# EAGLE design PCB111000_1_V2_CC (EAGLE 9.5.2)
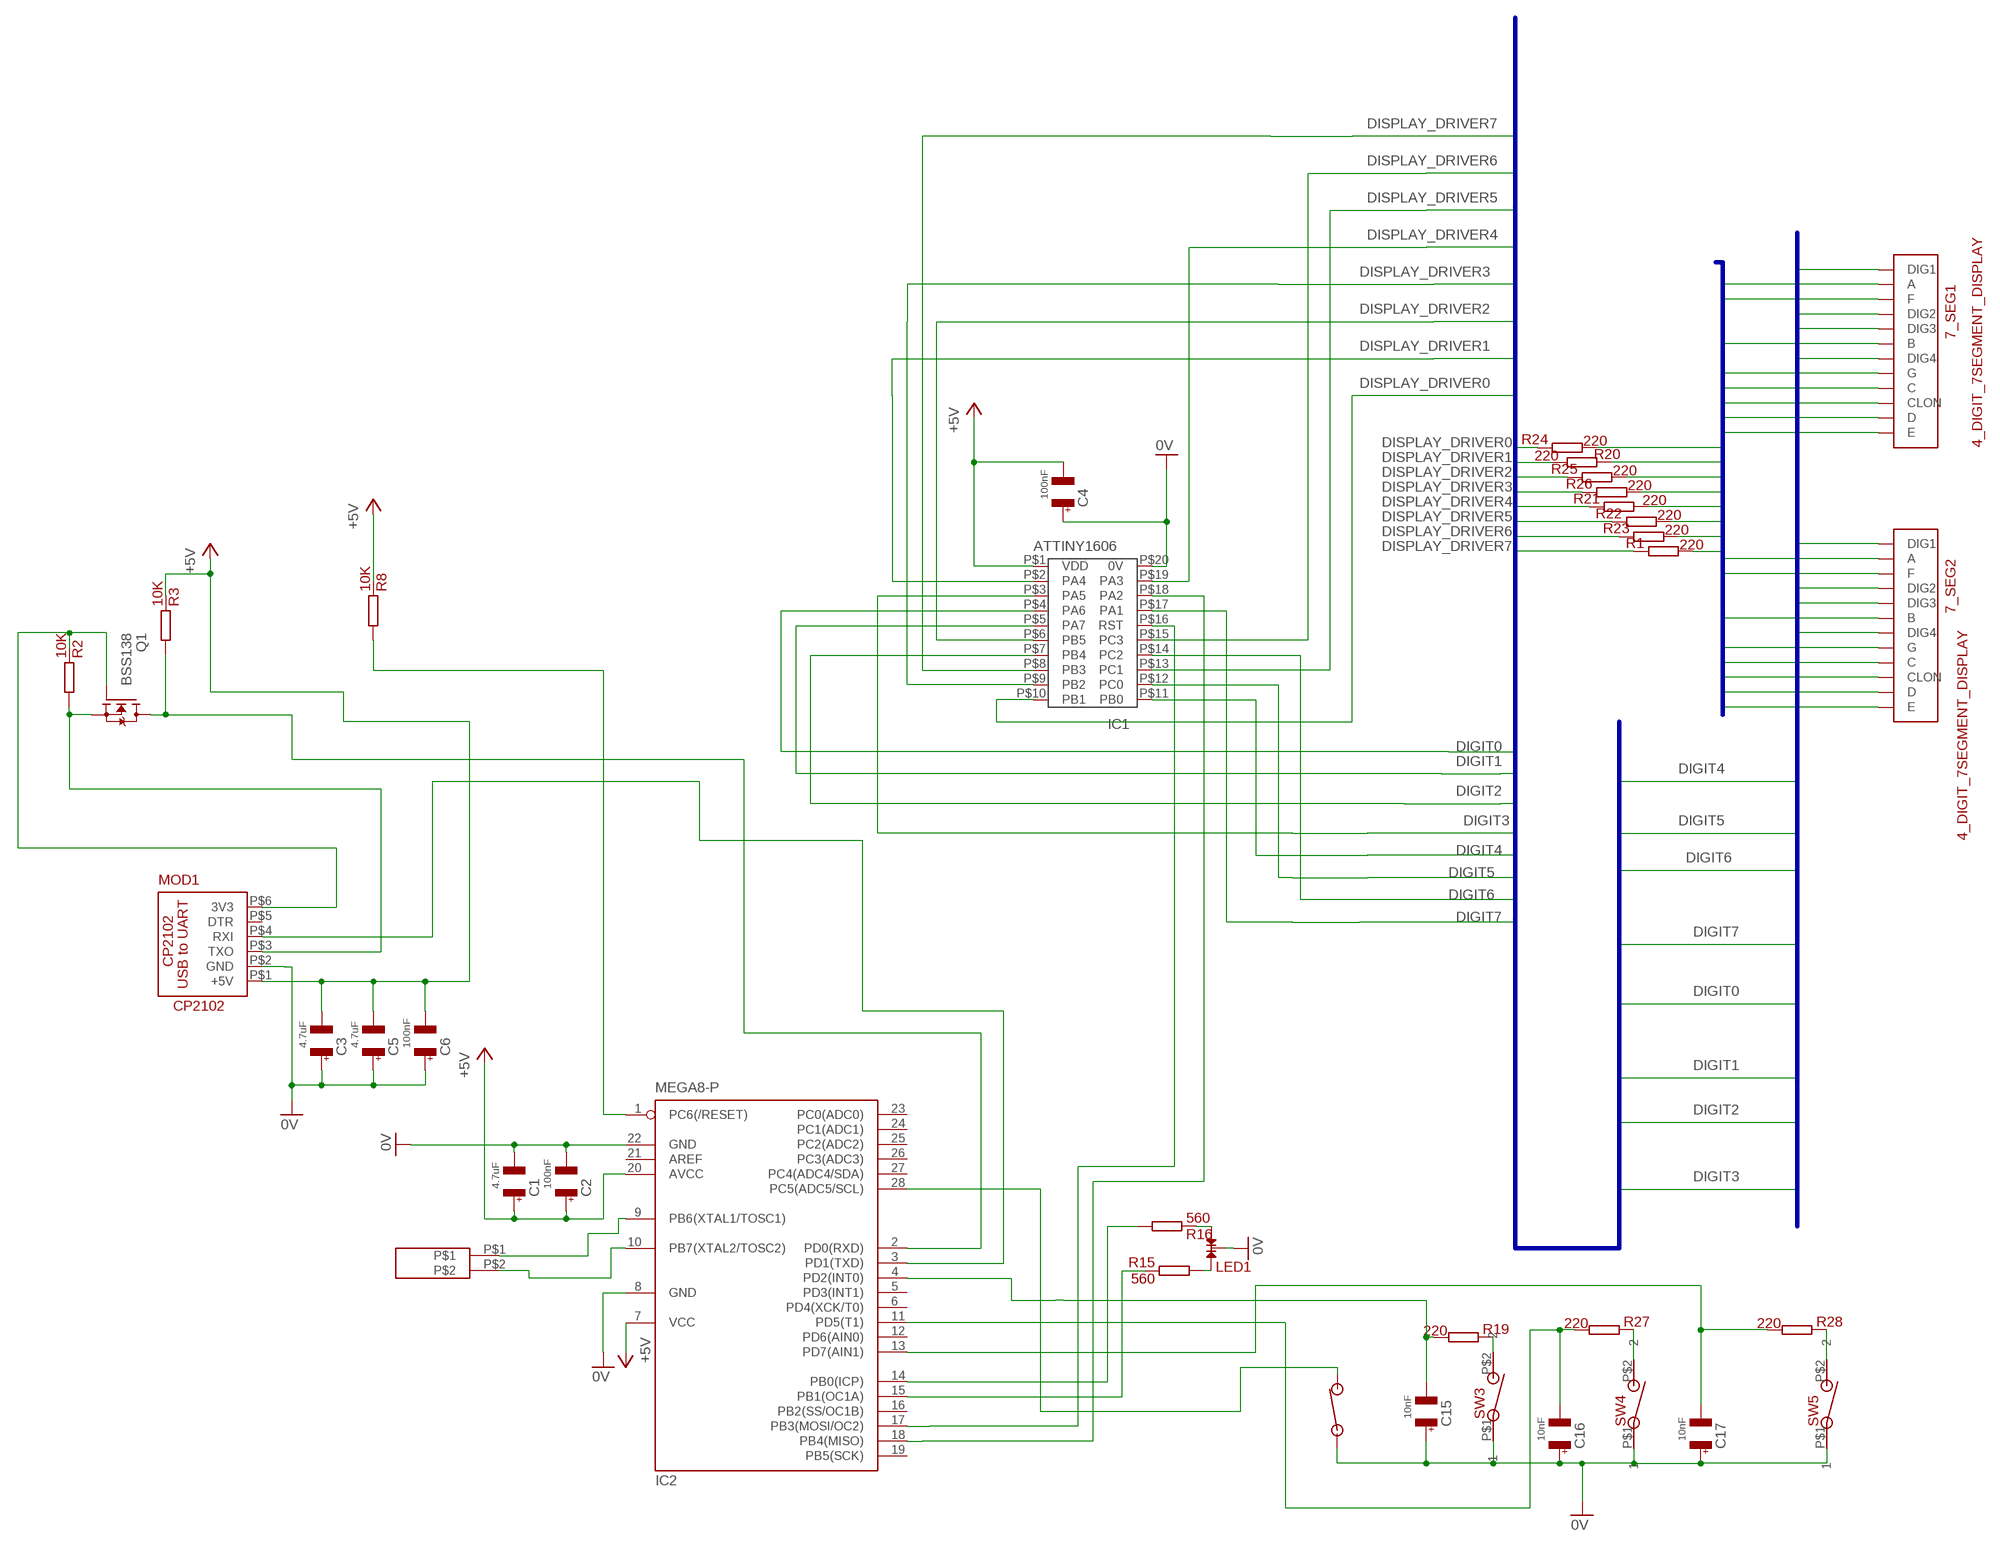
[diagram p0: schematic, sheet 1]

## Parts
7_SEG1  4_DIGIT_7SEGMENT_DISPLAY  [4_DIGIT_7SEGMENT_DISPLAY]
7_SEG2  4_DIGIT_7SEGMENT_DISPLAY  [4_DIGIT_7SEGMENT_DISPLAY]
C1  4.7uF  1206C  [1206@1]
C2  100nF  1206C  [1206@1]
C3  4.7uF  1206C  [1206@1]
C4  100nF  1206C  [1206@1]
C5  4.7uF  1206C  [1206@1]
C6  100nF  1206C  [1206@1]
C15  10nF  1206C  [1206@1]
C16  10nF  1206C  [1206@1]
C17  10nF  1206C  [1206@1]
IC1  ATTINY1606  [ATTINY1606]
IC2  MEGA8-P  [DIL28-3]
LED1  LED  [CA_DUAL_LED]
MOD1  CP2102  [CP2102]
Q1  BSS138  [SOT23]
R1  220  1206R  [1206@1]
R2  10K  1206R  [1206@1]
R3  10K  1206R  [1206@1]
R8  10K  1206R  [1206@1]
R15  560  1206R  [1206@1]
R16  560  1206R  [1206@1]
R19  220  1206R  [1206@1]
R20  220  1206R  [1206@1]
R21  220  1206R  [1206@1]
R22  220  1206R  [1206@1]
R23  220  1206R  [1206@1]
R24  220  1206R  [1206@1]
R25  220  1206R  [1206@1]
R26  220  1206R  [1206@1]
R27  220  1206R  [1206@1]
R28  220  1206R  [1206@1]
SW1  NO_SW  [SM_NO_PUSH_BUTTON]
SW3  NO_PB_1  [RE51-0711]
SW4  NO_PB_1  [RE51-0711]
SW5  NO_PB_1  [RE51-0711]
U$1  XTAL  [XTAL]

## Nets
0V: C1.P$2 C2.P$2 C3.P$1 C4.P$1 C5.P$1 C6.P$1 C15.P$1 C16.P$1 C17.P$1 IC1.P$20(0V) IC2.8(GND) IC2.22(GND) LED1.2 MOD1.P$2(GND) SW1.P$1 SW3.P$1 SW4.P$1 SW5.P$1
+5V: C1.P$1 C2.P$1 C3.P$2 C4.P$2 C5.P$2 C6.P$2 IC1.P$1(VDD) IC2.7(VCC) IC2.20(AVCC) MOD1.P$1(+5V) R3.P$2 R8.P$2
DIGIT0: 7_SEG1.P$12(DIG1) IC1.P$4(PA6)
DIGIT1: 7_SEG1.P$9(DIG2) IC1.P$5(PA7)
DIGIT2: 7_SEG1.P$8(DIG3) IC1.P$7(PB4)
DIGIT3: 7_SEG1.P$6(DIG4) IC1.P$3(PA5)
DIGIT4: 7_SEG2.P$12(DIG1) IC1.P$11(PB0)
DIGIT5: 7_SEG2.P$9(DIG2) IC1.P$12(PC0)
DIGIT6: 7_SEG2.P$8(DIG3) IC1.P$14(PC2)
DIGIT7: 7_SEG2.P$6(DIG4) IC1.P$17(PA1)
DISPLAY_DRIVER0: IC1.P$10(PB1) R24.P$2
DISPLAY_DRIVER1: IC1.P$2(PA4) R20.P$1
DISPLAY_DRIVER2: IC1.P$6(PB5) R25.P$2
DISPLAY_DRIVER3: IC1.P$9(PB2) R26.P$2
DISPLAY_DRIVER4: IC1.P$19(PA3) R21.P$2
DISPLAY_DRIVER5: IC1.P$13(PC1) R22.P$2
DISPLAY_DRIVER6: IC1.P$15(PC3) R23.P$2
DISPLAY_DRIVER7: IC1.P$8(PB3) R1.P$2
N$1: IC2.14(PB0(ICP)) R16.P$1
N$2: IC2.15(PB1(OC1A)) R15.P$2
N$3: LED1.1 R15.P$1
N$4: LED1.3 R16.P$2
N$5: IC2.28(PC5(ADC5/SCL)) SW1.P$2
N$6: IC1.P$16(RST) IC2.17(PB3(MOSI/OC2))
N$7: R27.P$2 SW4.P$2
N$8: R19.P$2 SW3.P$2
N$9: C15.P$2 IC2.4(PD2(INT0)) R19.P$1
N$10: IC1.P$18(PA2) IC2.18(PB4(MISO))
N$11: C17.P$2 IC2.13(PD7(AIN1)) R28.P$1
N$12: IC2.9(PB6(XTAL1/TOSC1)) U$1.P$1
N$13: IC2.1(PC6(/RESET)) R8.P$1
N$14: IC2.3(PD1(TXD)) MOD1.P$4(RXI)
N$15: MOD1.P$3(TXO) Q1.2(S) R2.P$1
N$16: R28.P$2 SW5.P$2
N$17: IC2.10(PB7(XTAL2/TOSC2)) U$1.P$2
N$18: MOD1.P$6(3V3) Q1.1(G) R2.P$2
N$19: C16.P$2 IC2.11(PD5(T1)) R27.P$1
N$40: IC2.2(PD0(RXD)) Q1.3(D) R3.P$1
SEVEN_SEG0: 7_SEG1.P$11(A) 7_SEG2.P$11(A) R24.P$1
SEVEN_SEG1: 7_SEG1.P$7(B) 7_SEG2.P$7(B) R20.P$2
SEVEN_SEG2: 7_SEG1.P$4(C) 7_SEG2.P$4(C) R25.P$1
SEVEN_SEG3: 7_SEG1.P$2(D) 7_SEG2.P$2(D) R26.P$1
SEVEN_SEG4: 7_SEG1.P$1(E) 7_SEG2.P$1(E) R21.P$1
SEVEN_SEG5: 7_SEG1.P$10(F) 7_SEG2.P$10(F) R22.P$1
SEVEN_SEG6: 7_SEG1.P$5(G) 7_SEG2.P$5(G) R23.P$1
SEVEN_SEG7: 7_SEG1.P$3(CLON) 7_SEG2.P$3(CLON) R1.P$1
Unconnected: IC2.5(PD3(INT1)) IC2.6(PD4(XCK/T0)) IC2.12(PD6(AIN0)) IC2.16(PB2(SS/OC1B)) IC2.19(PB5(SCK)) IC2.21(AREF) IC2.23(PC0(ADC0)) IC2.24(PC1(ADC1)) IC2.25(PC2(ADC2)) IC2.26(PC3(ADC3)) IC2.27(PC4(ADC4/SDA)) MOD1.P$5(DTR)

## Buses
SEVEN_SEG[0..7]
DIGIT0,DIGIT1,DIGIT2,DIGIT3,DIGIT4,DIGIT5,DIGIT6,DIGIT7,DISPLAY_DRIVER[0..7]
DIGIT[0..7],DIGIT3,DIGIT5

## Library data of the parts
7_SEG1 7_SEG2 = 1_marko:4_DIGIT_7SEGMENT_DISPLAY: Common Anode RE 55-1674
C1-C6 C15-C17 = 1_Home_library:1206C: 4.7uF RS 538-2335 100nF RS 264-4179
IC1 = home_library:ATTINY1606
IC2 = 1_Home_library:MEGA8-P: MICROCONTROLLER 8 Kbytes FLASH, 1 kbytes SRAM, 512 bytes EEPROM, USART, 4-channel 10 bit ADC, 2-channel 8 bit ADC Pin compatible with Atmega48, ATMega88, ATMega168 Source: avr.lbr; OC_FARNELL: unknown; OC_NEWARK: unknown
LED1 = 3_My_prog:LED: RS228-5770
MOD1 = home_library:CP2102
Q1 = home_library:BSS138
R1-R3 R8 R15 R16 R19-R28 = 1_Home_library:1206R
SW1 = 1_Home_library:NO_SW: SM NO push button RE 51-0709
SW3-SW5 = 1_3V3_Bootloader:NO_PB_1: RE 51-0711
U$1 = mo:XTAL

## Board
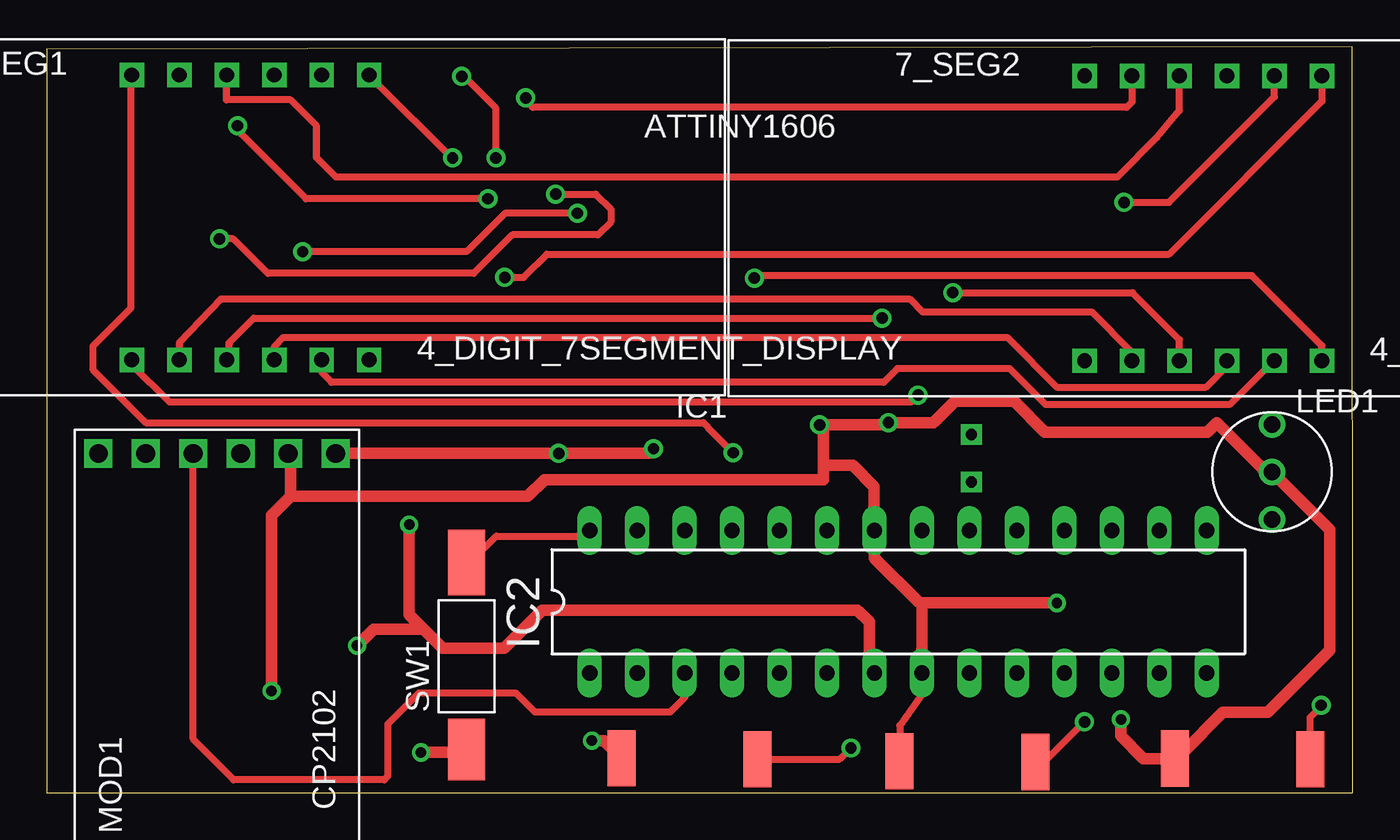
[diagram p1: board, top side]
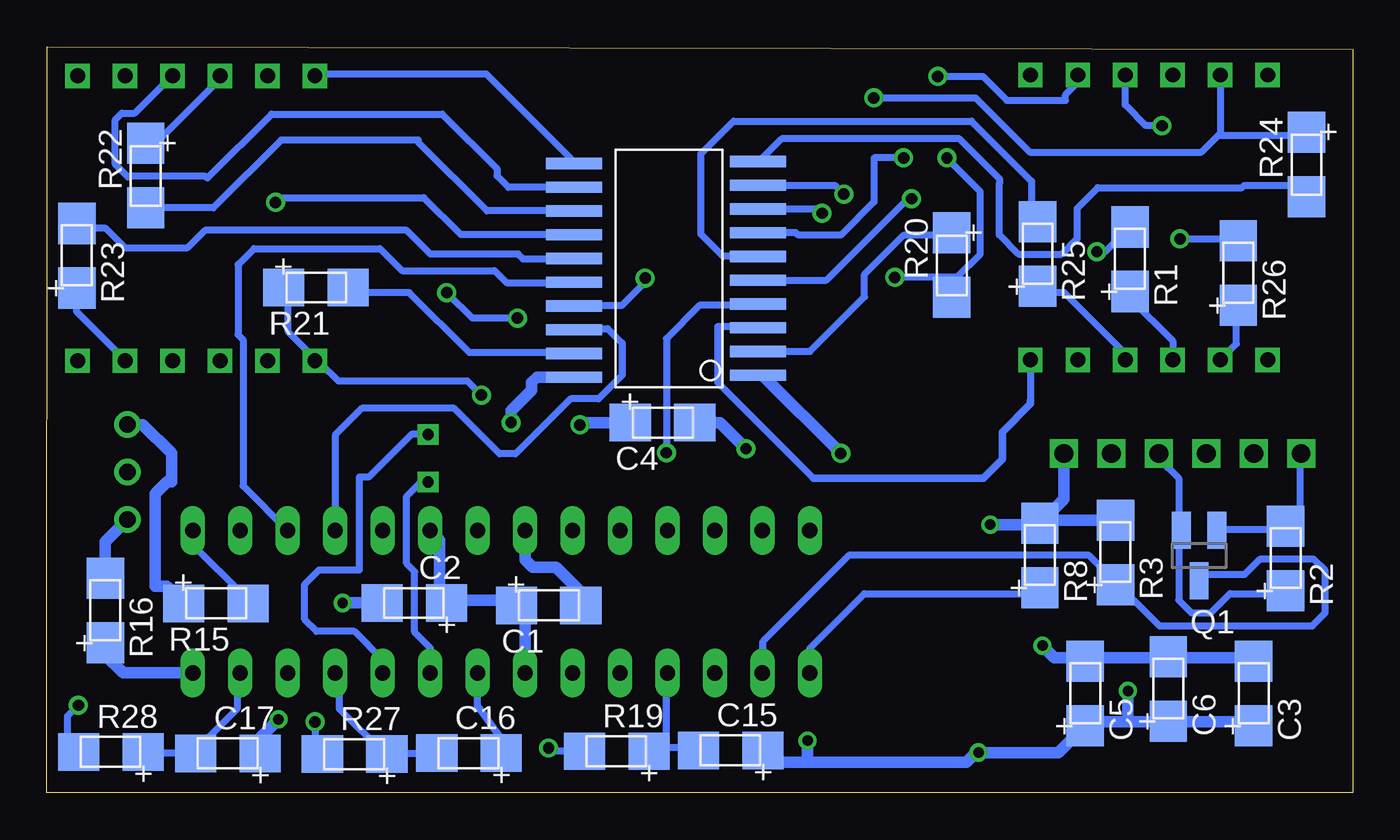
[diagram p2: board, bottom side, seen from below]

Size 69.91 x 39.93 mm. Coordinates in mm from the lower left corner, seen from the top.
Outline: 0,0 69.91,0 69.89,39.93 0,39.8 0,0
Copper layers (1*16): Top 0.035mm / dielectric 1.5mm / Bottom 0.035mm
Design rules "default *": minimum track width 15mil, minimum drill 22mil, track to track 12mil, track to pad 8mil, pad to pad 8mil, via to via 8mil, smd to smd 8mil, copper to edge 20mil, drill to drill 8mil, minimum pad ring 10mil, minimum via ring 8mil, stop-mask expansion 4mil, vias tented up to drill 0mil, thermal gap 10mil

### Footprints (pad centres in the part's own frame; a part is rotated, then mirrored left to right if it is on the bottom)
4_DIGIT_7SEGMENT_DISPLAY = drill 0.8 square: P$1 0,0; P$2 2.54,0; P$3 5.08,0; P$4 7.62,0; P$5 10.16,0; P$6 12.7,0; P$7 12.7,15.24; P$8 10.16,15.24; P$9 7.62,15.24; P$10 5.08,15.24; P$11 2.54,15.24; P$12 0,15.24
1206@1 = smd 2.2 x 2: P$1 -1.75,0; P$2 1.7,0
ATTINY1606 = smd 0.6 x 3: P$1 -5.08,-1.27; P$2 -3.81,-1.27; P$3 -2.54,-1.27; P$4 -1.27,-1.27; P$5 0,-1.27; P$6 1.27,-1.27; P$7 2.54,-1.27; P$8 3.81,-1.27; P$9 5.08,-1.27; P$10 6.35,-1.27; P$11 6.243,8.57; P$12 4.973,8.57; P$13 3.703,8.57; P$14 2.433,8.57; P$15 1.163,8.57; P$16 -0.107,8.57; P$17 -1.377,8.57; P$18 -2.647,8.57; P$19 -3.917,8.57; P$20 -5.187,8.57
DIL28-3 = drill 0.813 long: 1 -16.51,-3.81; 2 -13.97,-3.81; 3 -11.43,-3.81; 4 -8.89,-3.81; 5 -6.35,-3.81; 6 -3.81,-3.81; 7 -1.27,-3.81; 8 1.27,-3.81; 9 3.81,-3.81; 10 6.35,-3.81; 11 8.89,-3.81; 12 11.43,-3.81; 13 13.97,-3.81; 14 16.51,-3.81; 15 16.51,3.81; 16 13.97,3.81; 17 11.43,3.81; 18 8.89,3.81; 19 6.35,3.81; 20 3.81,3.81; 21 1.27,3.81; 22 -1.27,3.81; 23 -3.81,3.81; 24 -6.35,3.81; 25 -8.89,3.81; 26 -11.43,3.81; 27 -13.97,3.81; 28 -16.51,3.81
CA_DUAL_LED = drill 0.9: 1 0,2.54; 2 0,0; 3 0,-2.54
CP2102 = drill 1 square: P$1 0,-5.08; P$2 0,-2.54; P$3 0,0; P$4 0,2.54; P$5 0,5.08; P$6 0,7.62
SOT23 = smd 1 x 2: 1 -0.95,-1.35; 2 0.95,-1.35; 3 0,1.35
SM_NO_PUSH_BUTTON = smd 3.3 x 2: P$1 -2,1.5 | smd 3.5 x 2: P$2 8,1.5
RE51-0711 = smd 1.5 x 3: P$1 0.77,1.48; P$2 8.03,1.43
XTAL = drill 0.6 square: P$1 0,-1.27; P$2 0,1.27

### Placement (x,y rotation side)
7_SEG1  4.56,23.17 0 top
7_SEG2  55.56,23.12 0 top
C1  43.02,10.03 0 bottom
C2  50.26,10.16 180 bottom
C3  5.3,5.34 90 bottom
C4  36.93,19.81 0 bottom
C5  14.32,5.34 90 bottom
C6  9.88,5.59 90 bottom
C15  33.32,2.28 180 bottom
C16  47.33,2.13 180 bottom
C17  60.23,2.12 180 bottom
IC1  33.12,27.43 90 bottom
IC2  45.58,10.23 0 top
LED1  65.59,17.17 0 top
MOD1  10.38,18.16 90 top
Q1  8.23,12.7 180 bottom
R1  11.92,28.58 90 bottom
R2  3.59,12.57 90 bottom
R3  12.7,12.89 90 bottom
R8  16.75,12.73 90 bottom
R15  60.84,10.14 0 bottom
R16  66.77,9.78 90 bottom
R19  39.43,2.23 180 bottom
R20  21.47,28.22 270 bottom
R21  55.48,27.04 0 bottom
R22  64.61,33 270 bottom
R23  68.3,28.77 90 bottom
R24  2.48,33.61 270 bottom
R25  16.87,28.85 90 bottom
R26  6.13,27.84 90 bottom
R27  53.46,2.08 180 bottom
R28  66.5,2.19 180 bottom
SW1  23.97,4.32 90 top
SW3  30.01,0.38 0 top
SW4  44.88,0.22 0 top
SW5  59.61,0.36 0 top
U$1  49.5,17.91 0 top

### Tracks (layer width: path | path; a pad name or v marks a point on that pad's centre or on a via)
0V  (via drill 0.56, 0.61)
  Top 0.381: 22.59,2.19 SW1.P$1 | 65.55,16.89 65.55,17.17 LED1.2 | SW5.P$1 60.8,1.84 | SW4.P$1 45.66,1.74 45.66,3.6 46.85,5.25 IC2.8 | v20.04,2.16 20.06,2.19
  Top 0.61: MOD1.P$2 13.05,18.03 13.05,15.88 | 13.05,15.88 25.75,15.88 26.64,16.77 41.58,16.77 41.58,17.53 | 41.58,17.53 41.58,19.48 v41.37,19.69 44.93,19.69 v45.05,19.81 47.47,19.81 48.61,20.96 51.79,20.96 53.44,19.3 62.12,19.3 62.63,19.81 65.55,16.89 | IC2.8 46.85,10.02 46.71,10.16 | 46.71,10.16 44.31,12.56 IC2.22 44.29,14.05 44.29,16.38 43.15,17.53 41.58,17.53 | LED1.2 68.68,14.09 68.68,7.62 65.38,4.32 62.96,4.32 60.8,2.16 60.8,1.84 | 20.06,2.19 22.59,2.19 | 13.05,15.88 12.04,14.86 v12.04,5.46 | v29.18,2.8 29.84,2.8 SW3.P$1 | SW5.P$1 58.71,1.84 57.5,3.05 v57.5,3.94 | v54.07,10.16 46.71,10.16
  Bottom 0.381: 14.12,3.8 C5.P$1 | 10,3.8 C6.P$1 | C16.P$1 45.66,2.43 45.66,2.99 46.85,4.64 IC2.8
  Bottom 0.61: 12.04,3.8 10,3.8 5.52,3.8 C3.P$1 | 12.04,3.8 14.12,3.8 15.76,2.16 v20.04,2.16 20.16,2.16 20.67,1.65 29.18,1.65 | v45.05,19.81 45.05,20.45 43.95,21.55 43.95,21.97 43.68,22.25 IC1.P$20 | v12.04,5.46 12.04,3.8 | 29.18,1.65 30.95,1.65 C15.P$1 | v29.18,2.8 29.18,1.65 | v57.5,3.94 58.48,2.96 C17.P$1 | C2.P$2 v54.07,10.16 | IC2.22 44.31,12.46 43.91,12.07 42.64,12.07 41.32,10.75 C1.P$2 | C4.P$1 41.24,19.81 v41.37,19.69
+5V  (via drill 0.56, 0.61)
  Top 0.61: MOD1.P$1 v27.4,18.16 32.23,18.16 v32.48,18.42 | IC2.7 44.04,6.69 44.04,9.15 43.4,9.78 26.51,9.78 24.48,7.75 21.18,7.75 20.16,8.76 | v19.4,14.35 19.4,9.53 20.16,8.76 | v16.61,7.88 17.5,8.76 20.16,8.76
  Bottom 0.381: 5.55,7.23 C3.P$2 | 9.66,7.23 C6.P$2 10,7.23 | 14.12,7.23 C5.P$2 | 44.98,10.31 C1.P$1 | 48.41,10.31 C2.P$1
  Bottom 0.61: 9.66,7.23 5.55,7.23 | 10,7.23 14.12,7.23 | 44.98,10.31 48.41,10.31 48.88,10.79 48.88,13.53 IC2.20 | v32.48,18.42 33.88,19.81 C4.P$2 | v27.4,18.16 31.59,22.35 IC1.P$1 | v19.4,14.35 16.83,14.35 R8.P$2 16.59,14.59 | C5.P$2 14.53,7.24 15.97,7.24 v16.61,7.88 | IC2.7 44.31,9.57 C1.P$1 | R3.P$2 16.59,14.59 | MOD1.P$1 15.46,15.72 16.59,14.59
DIGIT0  (via drill 0.61)
  Top 0.381: v36.75,18.2 35.38,19.57 35.38,19.58 35.15,19.81 5.3,19.81 2.47,22.65 2.47,23.9 4.52,25.95 4.52,38.09 7_SEG1.P$12
  Bottom 0.381: v36.75,18.2 36.75,24.31 34.97,26.09 31.95,26.09 IC1.P$4
DIGIT1  (via drill 0.61)
  Top 0.381: v10.22,35.7 10.22,35.45 13.88,31.79 v23.62,31.79
  Bottom 0.381: v10.22,35.7 11.07,35.7 12.18,36.81 7_SEG1.P$9 | IC1.P$5 28.16,27.43 23.81,31.79 v23.62,31.79
DIGIT2  (via drill 0.61)
  Top 0.381: v24.05,33.97 24.05,36.64 22.35,38.34 v22.22,38.34
  Bottom 0.381: 7_SEG1.P$8 14.72,38.01 15.38,37.36 15.38,37.06 18.52,37.06 19.81,38.34 v22.22,38.34 | v24.05,33.97 25.62,33.97 25.62,31.62 27.4,29.85 29.69,29.85 29.81,29.97 IC1.P$7
DIGIT3
  Bottom 0.381: 28.88,16.84 34.01,21.97 34.01,24.97 31.92,24.97 IC1.P$3 | 7_SEG1.P$6 17.26,21.02
  Bottom 0.399: 17.26,21.02 17.26,20.81 18.77,19.3 18.77,17.86 19.78,16.84 28.88,16.84
DIGIT4
  Bottom 0.381: 7_SEG2.P$12 55.45,38.47 46.39,38.47 41.89,33.97 IC1.P$11
DIGIT5
  Bottom 0.381: 7_SEG2.P$9 63.5,38.09 65.21,36.37 65.9,36.37 66.24,36.03 66.24,33.63 65.55,32.94 65.48,33.02 61.44,33.02 61.31,32.89 57.88,36.32 48.74,36.32 45.82,33.4 45.82,33.02 45.2,32.41 IC1.P$12
DIGIT6  (via drill 0.61)
  Top 0.381: v57.67,31.6 60.08,31.6 65.72,37.24 7_SEG2.P$8
  Bottom 0.381: IC1.P$14 47.74,29.87 49.73,31.85 57.41,31.85 v57.67,31.6
DIGIT7  (via drill 0.61)
  Top 0.381: 7_SEG2.P$6 68.26,23.93 64.51,27.67 38.01,27.67 v37.88,27.55
  Bottom 0.381: v37.88,27.55 37.88,27.33 39.12,26.09 41.55,26.09 IC1.P$17
DISPLAY_DRIVER0
  Bottom 0.381: IC1.P$10 31.61,33.97 30.58,35 21.05,35 18.89,32.84 18.89,32.64 18.92,32.61 18.92,29.86 17.89,28.83 15.58,28.83 14.77,29.64 14.77,31.27 13.65,32.39 5.94,32.39 5.81,32.51 3.09,32.51 R24.P$2
DISPLAY_DRIVER1
  Bottom 0.381: R20.P$1 21.66,29.86 24.02,29.86 26.13,27.75 26.13,26.54 29.05,23.62 IC1.P$2
DISPLAY_DRIVER2
  Bottom 0.381: IC1.P$6 33.7,28.7 34.9,29.9 34.9,34.19 33.14,35.94 20.4,35.94 17.2,32.74 17.2,30.89 R25.P$2
DISPLAY_DRIVER3  (via drill 0.61)
  Top 0.381: v9.25,29.64 9.99,29.64 11.83,27.8 22.85,27.8 24.91,29.86 29.51,29.86 30.2,30.54 30.2,31.23 29.38,32.04 v27.25,32.04
  Bottom 0.381: v9.25,29.64 6.23,29.64 R26.P$2 | IC1.P$9 27.72,32.51 v27.25,32.04
DISPLAY_DRIVER4
  Bottom 0.381: R21.P$2 53.55,26.77 50.5,26.77 47.29,23.56 41.74,23.56 IC1.P$19
DISPLAY_DRIVER5
  Bottom 0.381: IC1.P$13 46.34,31.14 50.01,34.8 50.01,34.93 57.37,34.93 61,31.3 R22.P$2
DISPLAY_DRIVER6
  Bottom 0.381: R23.P$2 68.3,30.2 66.75,30.2 65.72,29.17 62.36,29.17 61.44,30.1 50.64,30.1 49.37,28.83 44.67,28.83 44.42,28.58 41.71,28.58 IC1.P$15
DISPLAY_DRIVER7  (via drill 0.61)
  Top 0.381: v13.7,28.96 22.47,28.96 24.53,31.01 v28.41,31.01
  Bottom 0.381: IC1.P$8 31.82,31.27 28.66,31.27 v28.41,31.01 | v13.7,28.96 13.25,28.96 R1.P$2
N$1
  Bottom 0.61: IC2.14 65.82,6.42 66.77,7.37 R16.P$1
N$2
  Bottom 0.381: IC2.15 62.09,13.29 59.38,10.58 59.38,10.31 R15.P$2
N$3
  Bottom 0.61: R15.P$1 63.5,11.05 64.11,11.05 64.11,16 63.47,16.64 63.22,16.64 63.22,18.16 64.77,19.71 LED1.1
N$4
  Bottom 0.61: LED1.3 66.77,13.45 R16.P$2
N$5
  Top 0.381: IC2.28 28.86,13.74 24.06,13.74 22.69,12.37 SW1.P$2
N$6
  Bottom 0.381: IC1.P$16 41.71,27.31 45.31,27.31 45.94,27.94 50.9,27.94 52.08,29.12 58.82,29.12 59.67,28.27 59.67,24.53 59.41,24.26 59.41,16.43 IC2.17
N$7  (via drill 0.61)
  Top 0.381: v55.56,3.8 53.41,1.65 SW4.P$2
  Bottom 0.381: v55.56,3.8 55.56,2.48 R27.P$2
N$8  (via drill 0.61)
  Top 0.381: SW3.P$2 42.45,1.81 v43.05,2.4
  Bottom 0.381: v43.05,2.4 42.87,2.23 R19.P$2
N$9
  Bottom 0.381: 36.75,2.43 35.03,2.43 C15.P$2 | 36.75,2.43 37.44,2.43 R19.P$1 36.75,2.43 | 36.75,2.43 36.75,6.2 IC2.4
N$10
  Bottom 0.381: IC1.P$18 41.63,24.84 39.89,24.84 39.11,24.07 39.11,22.35 40.38,21.08 41.88,21.08 44.83,18.14 45.66,18.14 48.1,20.58 53.06,20.58 54.47,19.16 IC2.18
N$11
  Bottom 0.381: IC2.13 59.72,6.2 59.72,4.5 62.01,2.21 C17.P$2 64.67,2.12 R28.P$1
N$12
  Bottom 0.381: IC2.9 49.39,7.77 50.21,8.59 50.21,11.83 50.64,12.26 50.64,15.88 49.88,16.64 U$1.P$1
N$13
  Bottom 0.381: IC2.1 29.07,7.73 26.15,10.66 16.86,10.66 R8.P$1
N$14
  Top 0.381: IC2.3 34.15,5.1 33.37,4.32 26.13,4.32 25.12,5.34 19.91,5.34 18.26,3.68 18.26,0.89 18.07,0.7 10,0.7 7.84,2.86 MOD1.P$4
N$15
  Bottom 0.381: MOD1.P$3 10.35,17.86 9.32,16.83 9.32,14.09 Q1.2 9.32,13.74 9.32,10.31 8.63,9.63 7.6,9.63 6.57,10.66 3.83,10.66 R2.P$1
N$16  (via drill 0.61)
  Top 0.381: SW5.P$2 67.64,4.04 68.22,4.62 v68.22,4.69
  Bottom 0.381: v68.22,4.69 68.8,4.1 68.8,2.41 68.6,2.21 67.97,2.21 67.98,2.19 R28.P$2
N$17
  Bottom 0.381: IC2.10 51.93,7.13 53.44,8.64 55.47,8.64 56.1,9.27 56.1,11.18 55.34,11.94 53.18,11.94 53.18,16.89 52.67,16.89 50.39,19.18 U$1.P$2
N$18
  Bottom 0.381: Q1.1 7.26,14.09 3.83,14.09 R2.P$2 3.49,14.43 2.8,15.11 2.8,17.86 MOD1.P$6
N$19
  Bottom 0.381: C16.P$2 49.09,2.08 51.49,2.08 R27.P$1 51.84,2.08 54.24,4.48 54.24,6.2 IC2.11
N$40
  Bottom 0.381: Q1.3 7.95,11.69 5.8,11.69 4.99,12.5 2.08,12.5 1.48,11.9 1.48,9.63 2.17,8.94 10.35,8.94 12.4,11 R3.P$1 12.75,11.34 14.12,12.71 26.96,12.71 31.56,8.11 31.61,6.8 IC2.2
SEVEN_SEG0  (via drill 0.61)
  Top 0.381: 7_SEG2.P$11 58.1,36.96 57.82,36.68 26.02,36.68 25.64,37.06 v25.64,37.19
  Bottom 0.381: R24.P$1 2.19,35.69 2.7,35.18 7.21,35.18 | v25.64,37.19 20.19,37.19 17.29,34.29 8.1,34.29 7.21,35.18 | 7_SEG1.P$11 7.1,35.29 7.21,35.18
SEVEN_SEG1  (via drill 0.61)
  Top 0.381: v21.73,33.97 21.66,33.97 17.55,38.09 7_SEG1.P$7 | 7_SEG2.P$7 68.26,37 60.09,28.83 26.78,28.83 25.53,27.58 v24.52,27.58
  Bottom 0.381: 21.32,27.46 21.32,26.77 R20.P$2 21.32,27.46 | 21.19,27.58 19.95,28.83 19.95,32.17 21.73,33.95 v21.73,33.97 | 21.19,27.58 21.32,27.46 | 21.19,27.58 v24.52,27.58
SEVEN_SEG2
  Top 0.381: 7_SEG2.P$4 63.18,22.82 62.07,21.72 54.07,21.72 51.42,24.37 12.67,24.37 12.18,23.88 7_SEG1.P$4
  Bottom 0.381: 7_SEG1.P$4 12.18,23.5 15.45,26.77 16.86,26.77 R25.P$1
SEVEN_SEG3
  Top 0.381: 7_SEG2.P$2 58.1,23.58 55.94,25.74 46.88,25.74 46.2,26.43 9.33,26.43 7.1,24.1 7_SEG1.P$2
  Bottom 0.381: R26.P$1 6.23,26.09 6.23,24.03 6.92,23.34 7_SEG1.P$2
SEVEN_SEG4  (via drill 0.61)
  Top 0.381: 7_SEG1.P$1 4.56,22.92 6.57,20.91 46.26,20.91 v46.64,21.29
  Bottom 0.381: R21.P$1 56.98,26.77 56.98,24.68 55.48,23.18 7_SEG2.P$1 55.27,23 54.31,22.05 47.4,22.05 v46.64,21.29
SEVEN_SEG5
  Top 0.381: 7_SEG2.P$10 60.64,36.52 59.44,35.08 57.3,32.94 15.49,32.94 14.45,33.99 14.45,35.69 13.05,37.08 9.62,37.08 9.62,38.4 7_SEG1.P$10
  Bottom 0.381: R22.P$1 64.52,35 63.84,35 60.75,38.09 7_SEG2.P$10
SEVEN_SEG6
  Top 0.381: 7_SEG1.P$5 14.72,22.5 15.25,21.97 44.81,21.97 45.54,22.7 51.56,22.7 53.47,20.78 63.33,20.78 65.55,23 7_SEG2.P$5
  Bottom 0.381: R23.P$1 68.3,26.77 68.3,25.74 65.9,23.34 7_SEG2.P$5
SEVEN_SEG7  (via drill 0.61)
  Top 0.381: 7_SEG2.P$3 60.64,24.26 58.12,26.77 v48.5,26.77 | v44.71,25.4 11.08,25.4 9.76,24.08 7_SEG1.P$3
  Bottom 0.381: v44.71,25.4 47.12,25.4 v48.5,26.77 | R1.P$1 11.92,26.48 9.64,24.19 7_SEG1.P$3